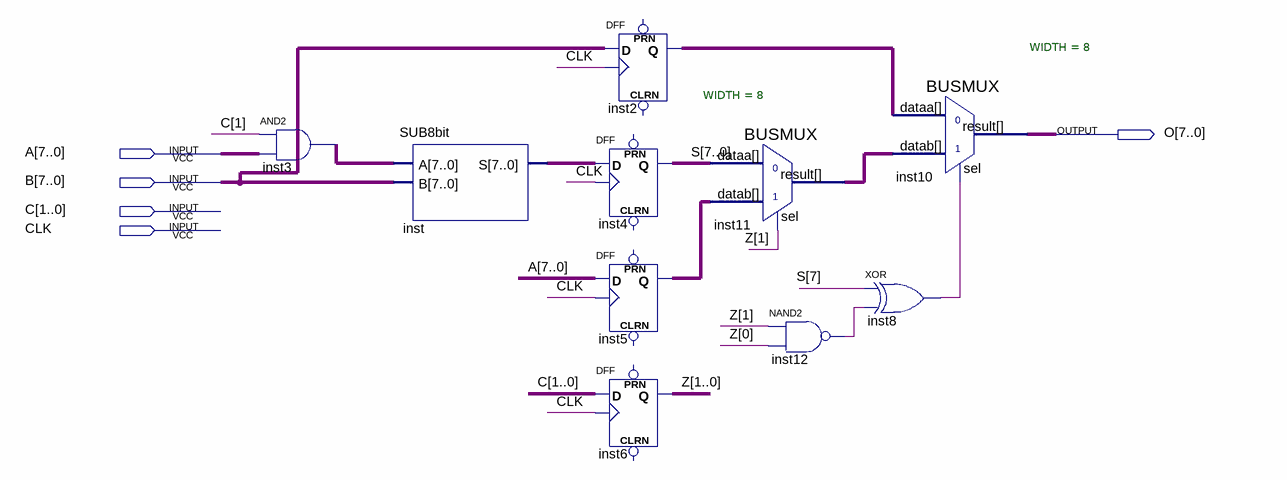
[diagram p0: schematic sheet]
// Quartus schematic ABS_MAX_MIN.bdf as structural Verilog: 10 symbols, 5 pins
module ABS_MAX_MIN (
  input  [7:0] A,
  input  [7:0] B,
  input  [1:0] C,
  input  CLK,
  output [7:0] O
);

  wire inst8_out, inst12_out;
  wire [1:0] Z;
  wire [7:0] inst2_q, inst3_out, inst5_q, inst11_result, inst_s, S;

  assign inst3_out = {8{C[1]}} & A;  // AND2 inst3, 8 bits wide
  SUB8bit inst (.A(inst3_out), .B(B), .S(inst_s));
  DFF inst2[7:0] (.CLK(CLK), .D(B), .Q(inst2_q));  // open: CLRN, PRN
  DFF inst4[7:0] (.CLK(CLK), .D(inst_s), .Q(S));  // open: CLRN, PRN
  DFF inst5[7:0] (.CLK(CLK), .D(A), .Q(inst5_q));  // open: CLRN, PRN
  DFF inst6[1:0] (.CLK(CLK), .D(C), .Q(Z));  // open: CLRN, PRN
  BUSMUX #(.WIDTH(8)) inst11 (.datab(inst5_q), .sel(Z[1]), .dataa(S), .result(inst11_result));
  nand inst12 (inst12_out, Z[1], Z[0]);
  BUSMUX #(.WIDTH(8)) inst10 (.datab(inst11_result), .sel(inst8_out), .dataa(inst2_q), .result(O));
  xor inst8 (inst8_out, S[7], inst12_out);
endmodule
